# Altium schematic sheet 13_FLOW_Sensor.SchDoc
size 420 x 297 mm; SheetNumber: 21; SheetTotal: 24
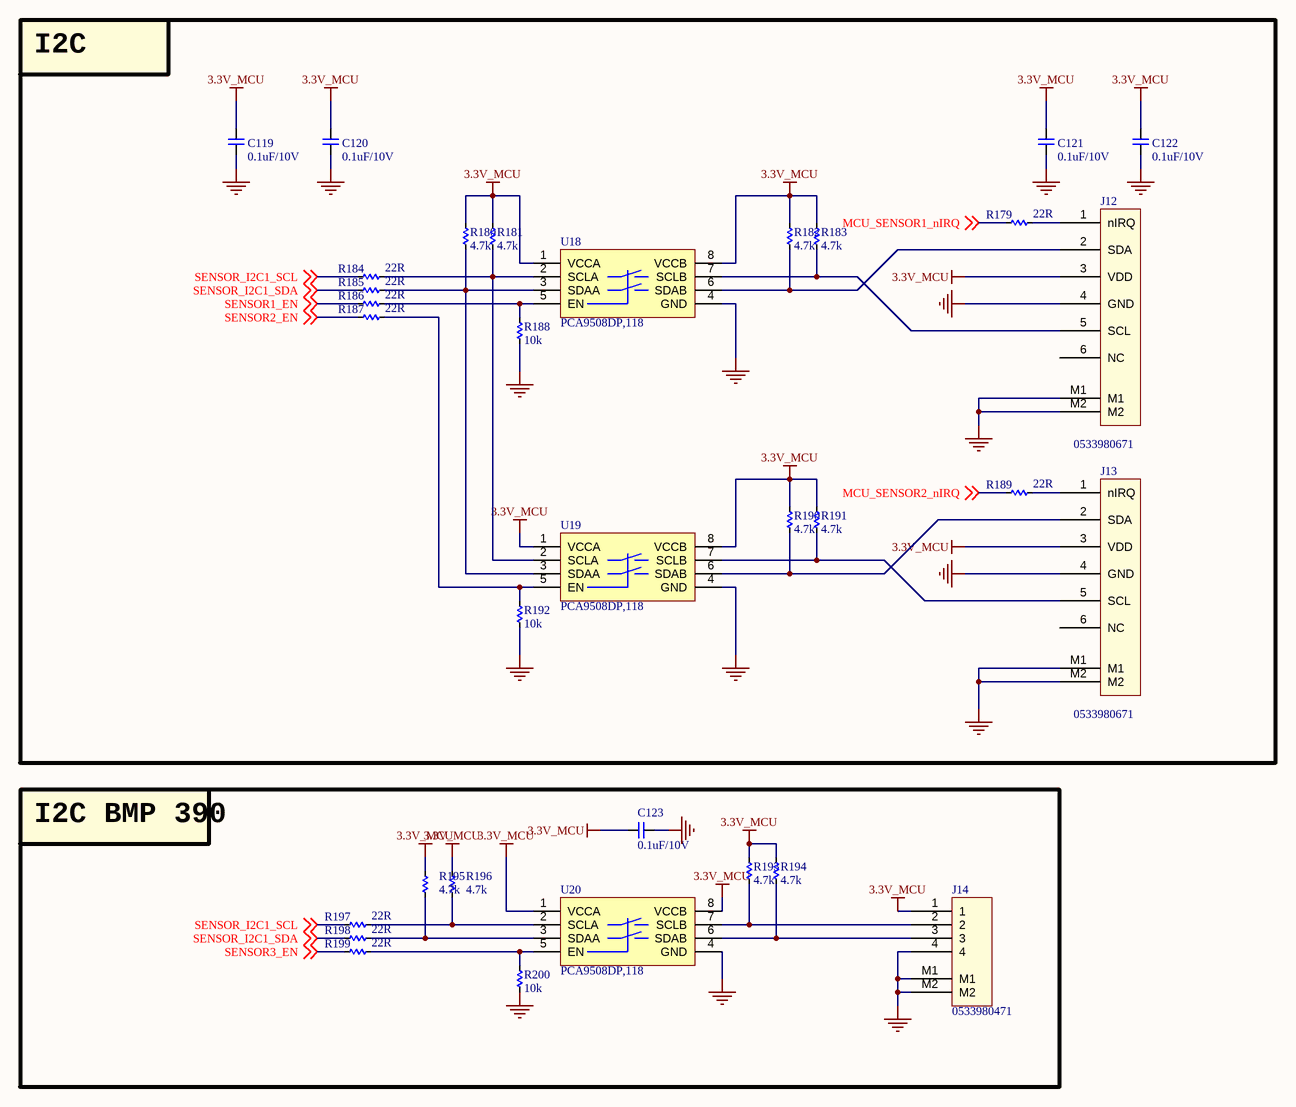
[diagram p0: 13_FLOW_Sensor.SchDoc]

## Parts
C119  0.1uF/10V  [CAP_C_1005X60]
C120  0.1uF/10V  [CAP_C_1005X60]
C121  0.1uF/10V  [CAP_C_1005X60]
C122  0.1uF/10V  [CAP_C_1005X60]
C123  0.1uF/10V  [CAP_C_1005X60]
J12  0533980671  [MOLEX_0533980671]
J13  0533980671  [MOLEX_0533980671]
J14  0533980471  [MOLEX_0533980471]
R179  22R  [RES_C_1005X40]
R180  4.7k  [RES_C_1005X40]
R181  4.7k  [RES_C_1005X40]
R182  4.7k  [RES_C_1005X40]
R183  4.7k  [RES_C_1005X40]
R184  22R  [RES_C_1005X40]
R185  22R  [RES_C_1005X40]
R186  22R  [RES_C_1005X40]
R187  22R  [RES_C_1005X40]
R188  10k  [RES_C_1005X40]
R189  22R  [RES_C_1005X40]
R190  4.7k  [RES_C_1005X40]
R191  4.7k  [RES_C_1005X40]
R192  10k  [RES_C_1005X40]
R193  4.7k  [RES_C_1005X40]
R194  4.7k  [RES_C_1005X40]
R195  4.7k  [RES_C_1005X40]
R196  4.7k  [RES_C_1005X40]
R197  22R  [RES_C_1005X40]
R198  22R  [RES_C_1005X40]
R199  22R  [RES_C_1005X40]
R200  10k  [RES_C_1005X40]
U18  PCA9508DP,118  [TSOP8]
U19  PCA9508DP,118  [TSOP8]
U20  PCA9508DP,118  [TSOP8]

## Blocks framed on the sheet
I2C: C119-C122 J12 J13 R179-R192 U18 U19
I2C BMP 390: C123 J14 R193-R200 U20

## Nets
3.3V_MCU: C119.2 C120.2 C121.2 C122.2 C123.2 J12.3(VDD) J13.3(VDD) J14.1 R180.1 R181.1 R182.1 R183.1 R190.1 R191.1 R193.1 R194.1 R195.1 R196.1 U18.1(VCCA) U18.8(VCCB) U19.1(VCCA) U19.8(VCCB) U20.1(VCCA) U20.8(VCCB)
GND: C119.1 C120.1 C121.1 C122.1 C123.1 J12.4(GND) J12.M1 J12.M2 J13.4(GND) J13.M1 J13.M2 J14.4 J14.M1 J14.M2 R188.2 R192.2 R200.2 U18.4(GND) U19.4(GND) U20.4(GND)
MCU_SENSOR1_nIRQ: R179.2 ; off-sheet MCU_SENSOR1_nIRQ
MCU_SENSOR2_nIRQ: R189.2 ; off-sheet MCU_SENSOR2_nIRQ
SENSOR1_EN: R186.2 ; off-sheet SENSOR1_EN
SENSOR2_EN: R187.2 ; off-sheet SENSOR2_EN
SENSOR3_EN: R199.2 ; off-sheet SENSOR3_EN
SENSOR_I2C1_SCL: R184.2 R197.2 ; off-sheet SENSOR_I2C1_SCL
SENSOR_I2C1_SDA: R185.2 R198.2 ; off-sheet SENSOR_I2C1_SDA
NetJ12_1: J12.1(nIRQ) R179.1
NetJ12_2: J12.2(SDA) R182.2 U18.6(SDAB)
NetJ12_5: J12.5(SCL) R183.2 U18.7(SCLB)
NetJ13_1: J13.1(nIRQ) R189.1
NetJ13_2: J13.2(SDA) R190.2 U19.6(SDAB)
NetJ13_5: J13.5(SCL) R191.2 U19.7(SCLB)
NetJ14_2: J14.2 R193.2 U20.7(SCLB)
NetJ14_3: J14.3 R194.2 U20.6(SDAB)
NetR180_2: R180.2 R185.1 U18.3(SDAA) U19.3(SDAA)
NetR181_2: R181.2 R184.1 U18.2(SCLA) U19.2(SCLA)
NetR186_1: R186.1 R188.1 U18.5(EN)
NetR187_1: R187.1 R192.1 U19.5(EN)
NetR195_2: R195.2 R198.1 U20.3(SDAA)
NetR196_2: R196.2 R197.1 U20.2(SCLA)
NetR199_1: R199.1 R200.1 U20.5(EN)

Not connected (* = marked no-connect by the designer): J12 6(NC); J13 6(NC)

## Notes on the sheet
- Project:
- BEE-PC1
- Sub-system:
- NANORACK_EXP_CONTROLLER
- Design by:
- SANG HUYNH
- BAO BUI Q.
- Sheet title:
- Sheet
- A3
- of
- Checked by:
- Approved by:
- VU PHAM
- Revision:
- Document No:
- V1.2.2
- Size:
- Date:

## Library data of the parts
C119-C123 = _CAP_C_2: CAP CHIP
J12 J13 = FLOW_SENSOR
J14 = Header 4x1_2M
R179-R200 = _RES_B_2: RES